# Altium schematic sheet Pwr.SchDoc
size A4
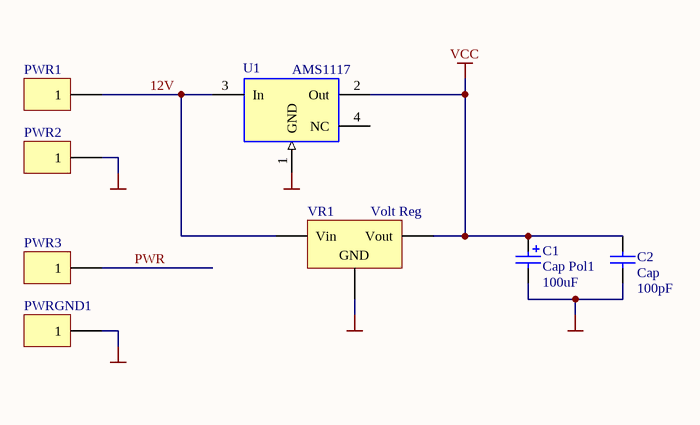
[diagram p0: Pwr.SchDoc]

## Parts
C1  Cap Pol1  value 100uF  [RAD-0.3]
C2  Cap  value 100pF  [RAD-0.3]
PWR1  Header TOP 1  [PIN1]  (value not drawn)
PWR2  Header TOP 1  [PIN1]  (value not drawn)
PWR3  Header TOP 1  [PIN1]  (value not drawn)
PWRGND1  Header TOP 1  [PIN1]  (value not drawn)
U1  AMS1117  [SOT223_M]
VR1  Volt Reg  [D2PAK_N]

## Nets
GND: C1.2 C2.1 PWR2.1 PWRGND1.1 U1.1(GND) VR1.2(GND)
VCC: C1.1 C2.2 U1.2(Out) VR1.3(Vout)
12V: PWR1.1 U1.3(In) VR1.1(Vin)
PWR: PWR3.1

Not connected (* = marked no-connect by the designer): U1 4(NC)

## Library data of the parts
C1 = Cap Pol1: Polarized Capacitor (Radial); Published: 8-Jun-2000; LatestRevisionDate: 17-Jul-2002; LatestRevisionNote: Re-released for DXP Platform.; PackageReference: RB7.6-15; Publisher: Altium Limited; PackageDescription: Polarized Capacitor (Radial); 2 Leads
C2 = Cap: Capacitor; Published: 8-Jun-2000; LatestRevisionDate: 17-Jul-2002; LatestRevisionNote: Re-released for DXP Platform.; PackageReference: RAD-0.3; Publisher: Altium Limited; PackageDescription: Radial Cap, Thru-Hole; 2 Leads; 0.3 in Pin Spacing
PWR1-PWR3 PWRGND1 = Header TOP 1: Header, 1Pin; LatestRevisionDate: 17-Jul-2002; LatestRevisionNote: Re-released for DXP Platform.; Publisher: Altium Limited
U1 = AMS1117: VOLTAGE REGULATOR; Published: 24-Mar-1999; LatestRevisionDate: 17-Jul-2002; LatestRevisionNote: Re-released for DXP Platform.; PackageReference: DIP-6; Publisher: Altium Limited; Code_JEDEC: MO-001-AM
VR1 = Volt Reg: Voltage Regulator; Published: 24-Mar-1999; LatestRevisionDate: 29-May-2009; LatestRevisionNote: IPC-7351 Footprint Added.; PackageReference: D2PAK; Publisher: Altium Limited; PackageDescription: 3-Pin Transistor Outline Package 2.54 mm Pitch, 15.1 mm Lead Span